# EasyEDA schematic Schematic_Condensate-Sensor-Relay-V1.json
TITLE: Condensate Sensor Relay - V1; REV: 1.0; Date: 2024-06-08; Sheet: 1/1; Drawn By: DJL19229; Company: Day Controls
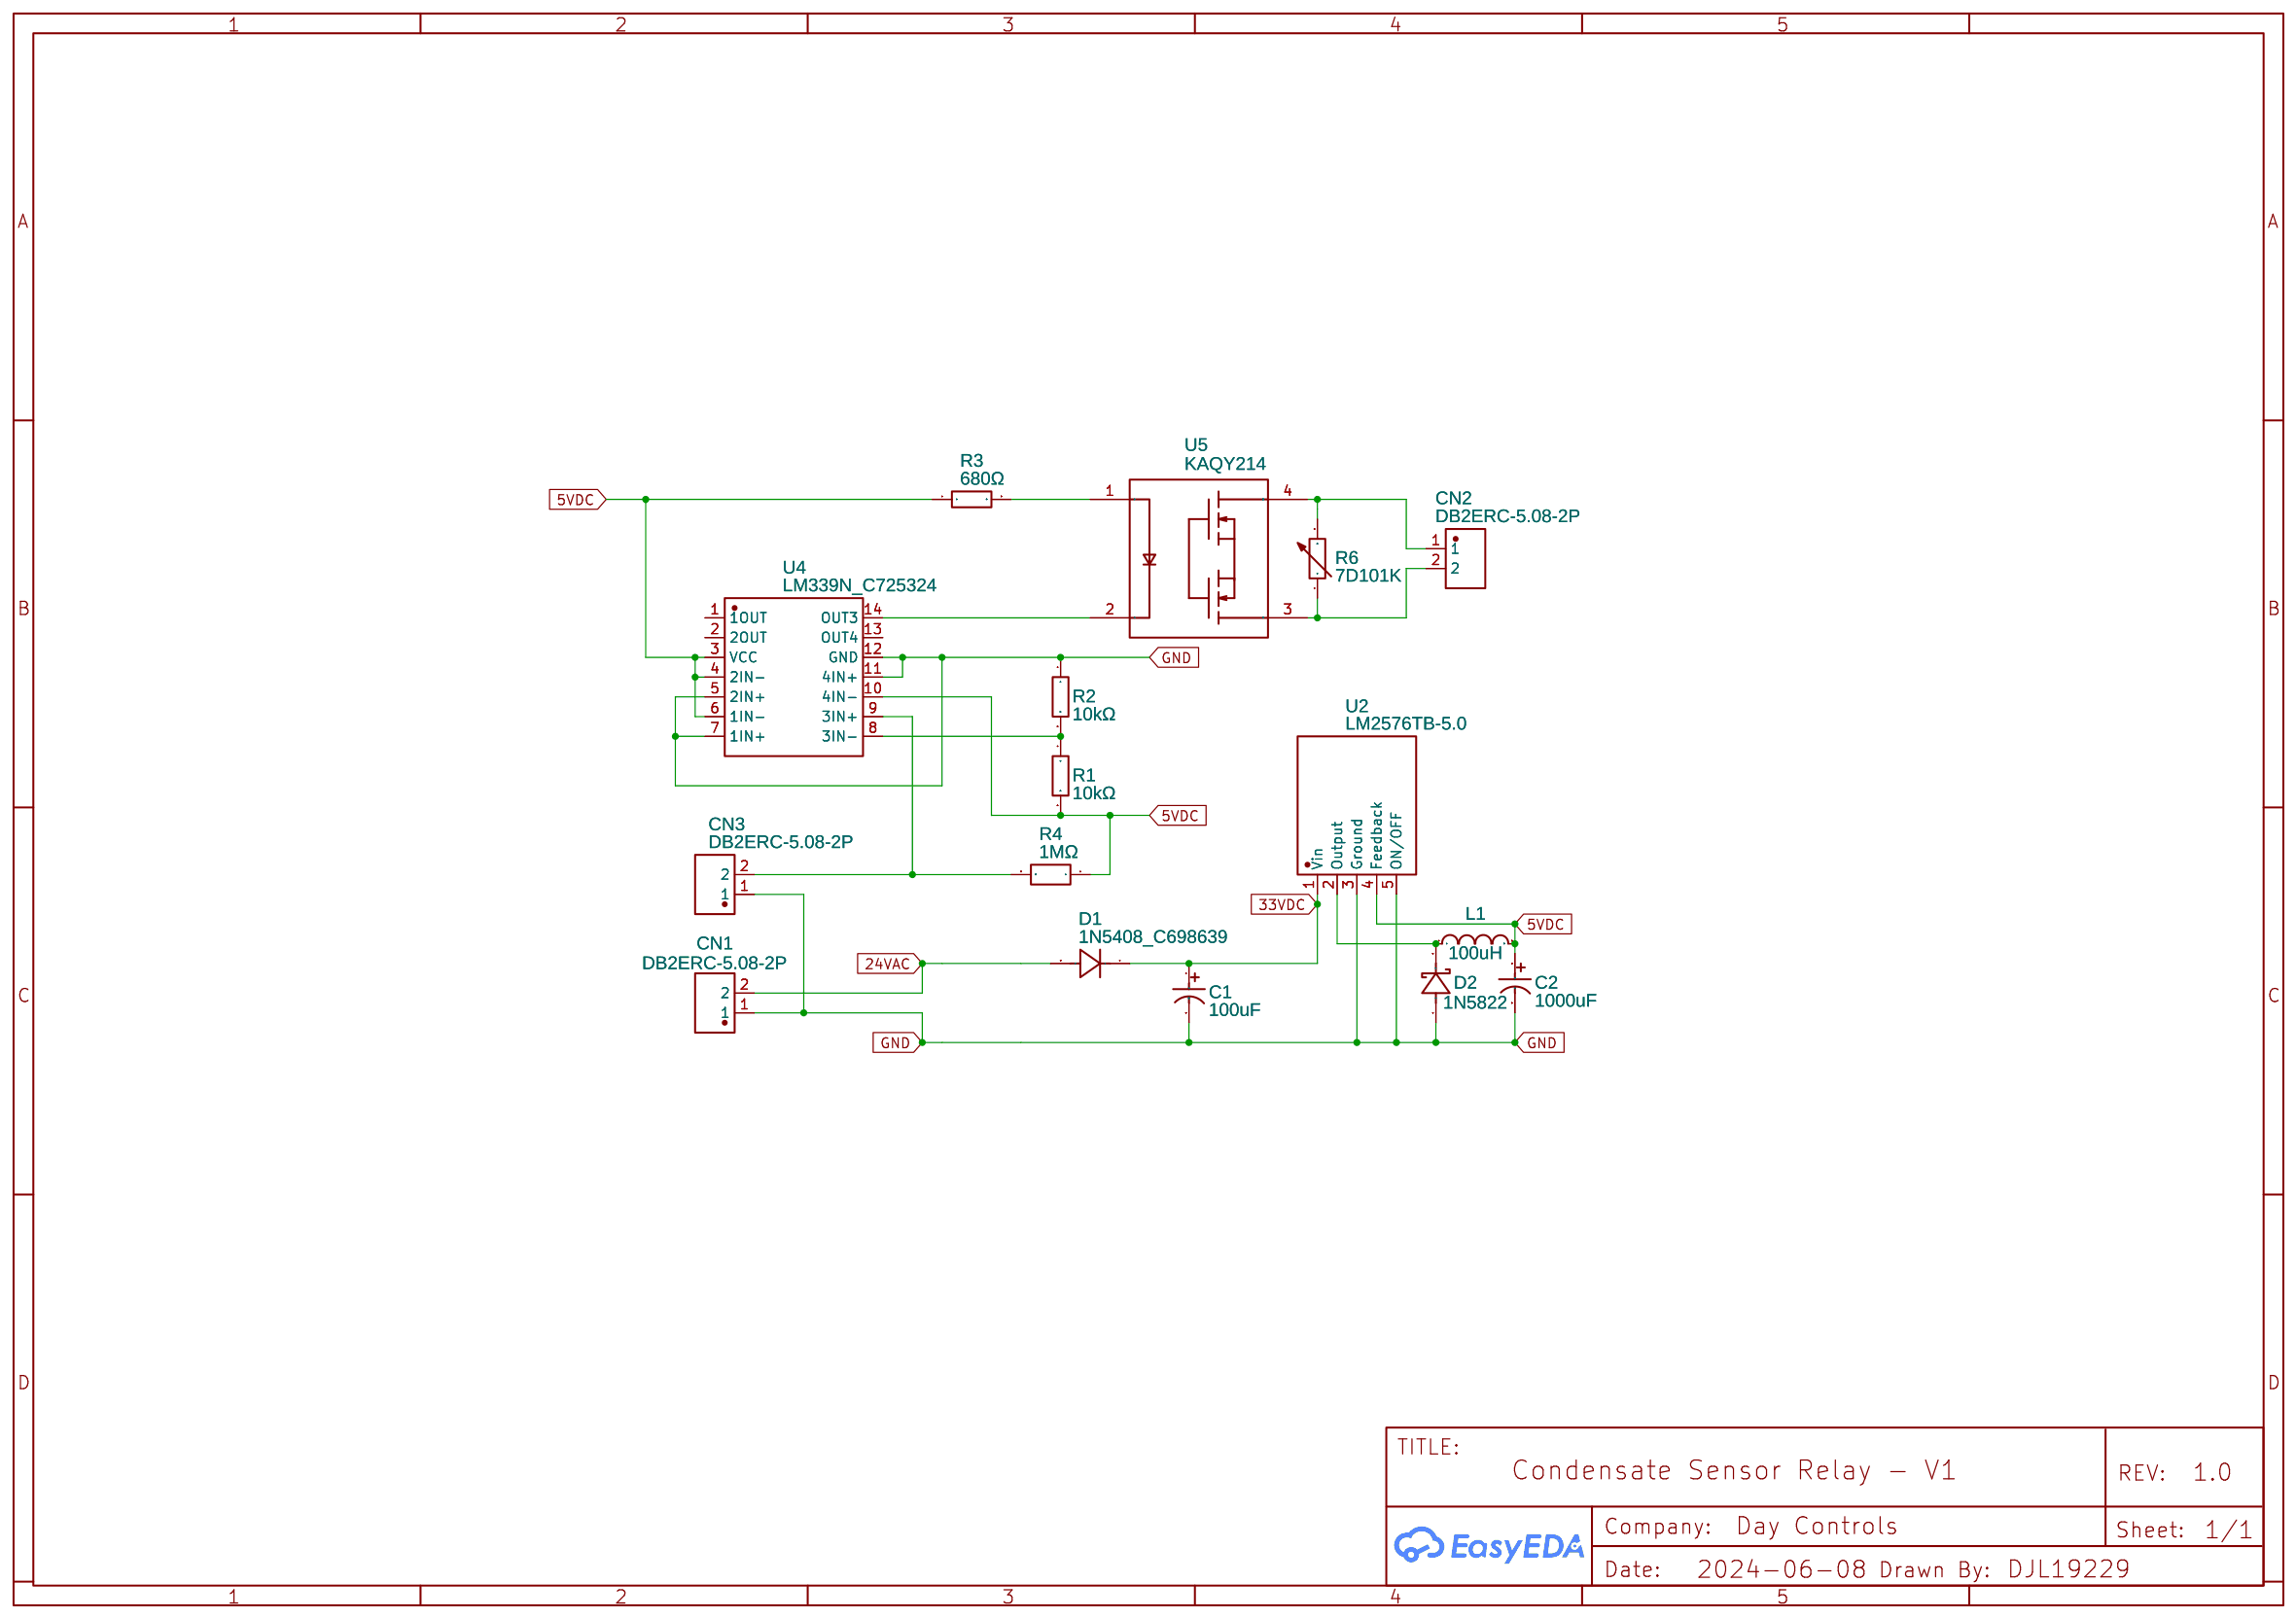
[diagram p0: schematic sheet]

## Parts
C1  100uF  [CAP-TH_BD8.0-P3.50-D0.6-FD]
C2  1000uF  [CAP-TH_BD13.0-P5.00-D1.2-FD]
CN1  DB2ERC-5.08-2P  [CONN-TH_2P-P5.08_DB2ERC-5.08-2P]
CN2  DB2ERC-5.08-2P  [CONN-TH_2P-P5.08_DB2ERC-5.08-2P]
CN3  DB2ERC-5.08-2P  [CONN-TH_2P-P5.08_DB2ERC-5.08-2P]
D1  1N5408_C698639  [DO-201AD_BD5.3-L8.4-P12.50-D1.4-RD]
D2  1N5822  [DO-201AD_BD5.3-L8.4-P12.50-D1.4-FD]
L1  100uH  [IND-TH_BD10.0-P5.00-D0.7]
R1  10kΩ  [RES-TH_BD2.3-L6.5-P10.50-D0.5]
R2  10kΩ  [RES-TH_BD2.3-L6.5-P10.50-D0.5]
R3  680Ω  [RES-TH_BD2.3-L6.5-P10.50-D0.5]
R4  1MΩ  [RES-TH_BD2.3-L6.5-P10.50-D0.5]
R6  7D101K  [RES-TH_L9.0-W3.4-P5.00-D0.7-S1.50]
U2  LM2576TB-5.0  [TO-220-5_L10.2-W4.8-P1.70-TL]
U4  LM339N_C725324  [DIP-14_L19.0-W7.0-P2.54-LS7.6-BL]
U5  KAQY214  [DIP-4_L4.6-W6.5-P2.54-LS7.6-BL]

## Library data of the parts
C1 = 100uF 50V 8*12Black high frequency: Supplier: LCSC; Manufacturer: CX(承兴); Manufacturer Part: GR107M050F12RR0VH4FP0; Supplier Part: C45102; JLCPCB Part Class: Extended Part
C2 = 35YXJ1000M12.5X20: Supplier: LCSC; Manufacturer: rubycon(红宝石); Supplier Part: C88743; JLCPCB Part Class: Extended Part
CN1-CN3 = DB2ERC-5.08-2P: Supplier: LCSC; Supplier Part: C395737; Manufacturer: DIBO(地博电气); Manufacturer Part: DB2ERC-5.08-2P-GN; Contributor: LCSC; JLCPCB Part Class: Extended Part
D1 = 1N5408_C698639: Supplier: LCSC; Supplier Part: C698639; Manufacturer: YANGJIE(扬杰); Manufacturer Part: 1N5408; Contributor: LCSC; JLCPCB Part Class: Extended Part
D2 = 1N5822_C3018526: Supplier: LCSC; Supplier Part: C3018526; Manufacturer: FUXINSEMI(富芯森美); Contributor: lcsc; JLCPCB Part Class: Extended Part
L1 = VLU0810-101K: Supplier: LCSC; Manufacturer: FH(风华); Supplier Part: C72630; JLCPCB Part Class: Extended Part
R1 R2 = MF1/4W-10KΩ±1% T52: Contributor: LCSC; Supplier: LCSC; Supplier Part: C119347; Manufacturer: CCO(千志电子); Manufacturer Part: MF1/4W-10KΩ±1% T; JLCPCB Part Class: Extended Part; link: https://lcsc.com/eda_search?q=C119347&%26type=1&ref=editor
R3 = MF1/2WS-680Ω±1% T52: Contributor: LCSC; Supplier: LCSC; Supplier Part: C129894; Manufacturer: CCO(千志电子); Manufacturer Part: MF1/2WS-680Ω±1% T; JLCPCB Part Class: Extended Part
R4 = MF1/4W-1MΩ±1%T52: Supplier: LCSC; Supplier Part: C714052; Manufacturer: Huaxing Mechanical-Elec.; Contributor: LCSC; JLCPCB Part Class: Extended Part
R6 = 7D101K: Supplier: LCSC; Manufacturer: HEL(鸿志); Supplier Part: C136806; JLCPCB Part Class: Extended Part; link: https://lcsc.com/eda_search?q=C136806&%26type=1&ref=editor
U2 = LM2576TB-5.0: Supplier: LCSC; Supplier Part: C5160073; Manufacturer: HGSEMI(华冠); link: https://atta.szlcsc.com/upload/public/pdf/source/20220920/BAE03355F1D658EA05EE543F8BD8FFC3.pdf; Contributor: lcsc
U4 = LM339N_C725324: Contributor: LCSC; Supplier: LCSC; Supplier Part: C725324; Manufacturer: HGSEMI; Manufacturer Part: LM339N; JLCPCB Part Class: Extended Part; link: https://lcsc.com/eda_search?q=C725324&%26type=1&ref=editor
U5 = KAQY214: Supplier: LCSC; Manufacturer: cosmo(冠西); Contributor: LCSC; Supplier Part: C136415; JLCPCB Part Class: Extended Part

## Nets
5VDC: C2.1 L1.2 R1.2 R3.1 R4.1 U2.4(Feedback) U4.3(VCC) U4.4(2IN-) U4.6(1IN-) U4.10(4IN-)
24VAC: CN1.2 D1.2(A)
33VDC: C1.1 D1.1(K) U2.1(Vin)
GND: C1.2 C2.2 CN1.1 CN3.1 D2.1(A) R2.1 U2.3(Ground) U2.5(ON/OFF) U4.5(2IN+) U4.7(1IN+) U4.11(4IN+) U4.12(GND)
Net-(CN2-1): CN2.1 R6.2 U5.4(S)
Net-(CN2-2): CN2.2 R6.1 U5.3(S1)
Net-(CN3-2): CN3.2 R4.2 U4.9(3IN+)
Net-(D2-2): D2.2(K) L1.1 U2.2(Output)
Net-(R1-1): R1.1 R2.2 U4.8(3IN-)
Net-(R3-2): R3.2 U5.1(A)
Net-(U4-14): U4.14(OUT3) U5.2(C)

Not connected (* = marked no-connect by the designer): U4 1(1OUT) 2(2OUT) 13(OUT4)
